# Altium schematic sheet fpga-bank3.SchDoc: FPGA - Bank 3
size Legal; CheckedBy: J. Brinton; CompanyName: Signal Laboratories, Inc.; DrawnBy: J. Brinton; Engineer: J. Brinton; Address1: 3479 Edison Way; Address2: Menlo Park CA 94025; Address3: +1 (877) 778-8435; Address4: siglabs.com; DocumentNumber: 30; Revision: 2b; SheetNumber: 31; SheetTotal: 58
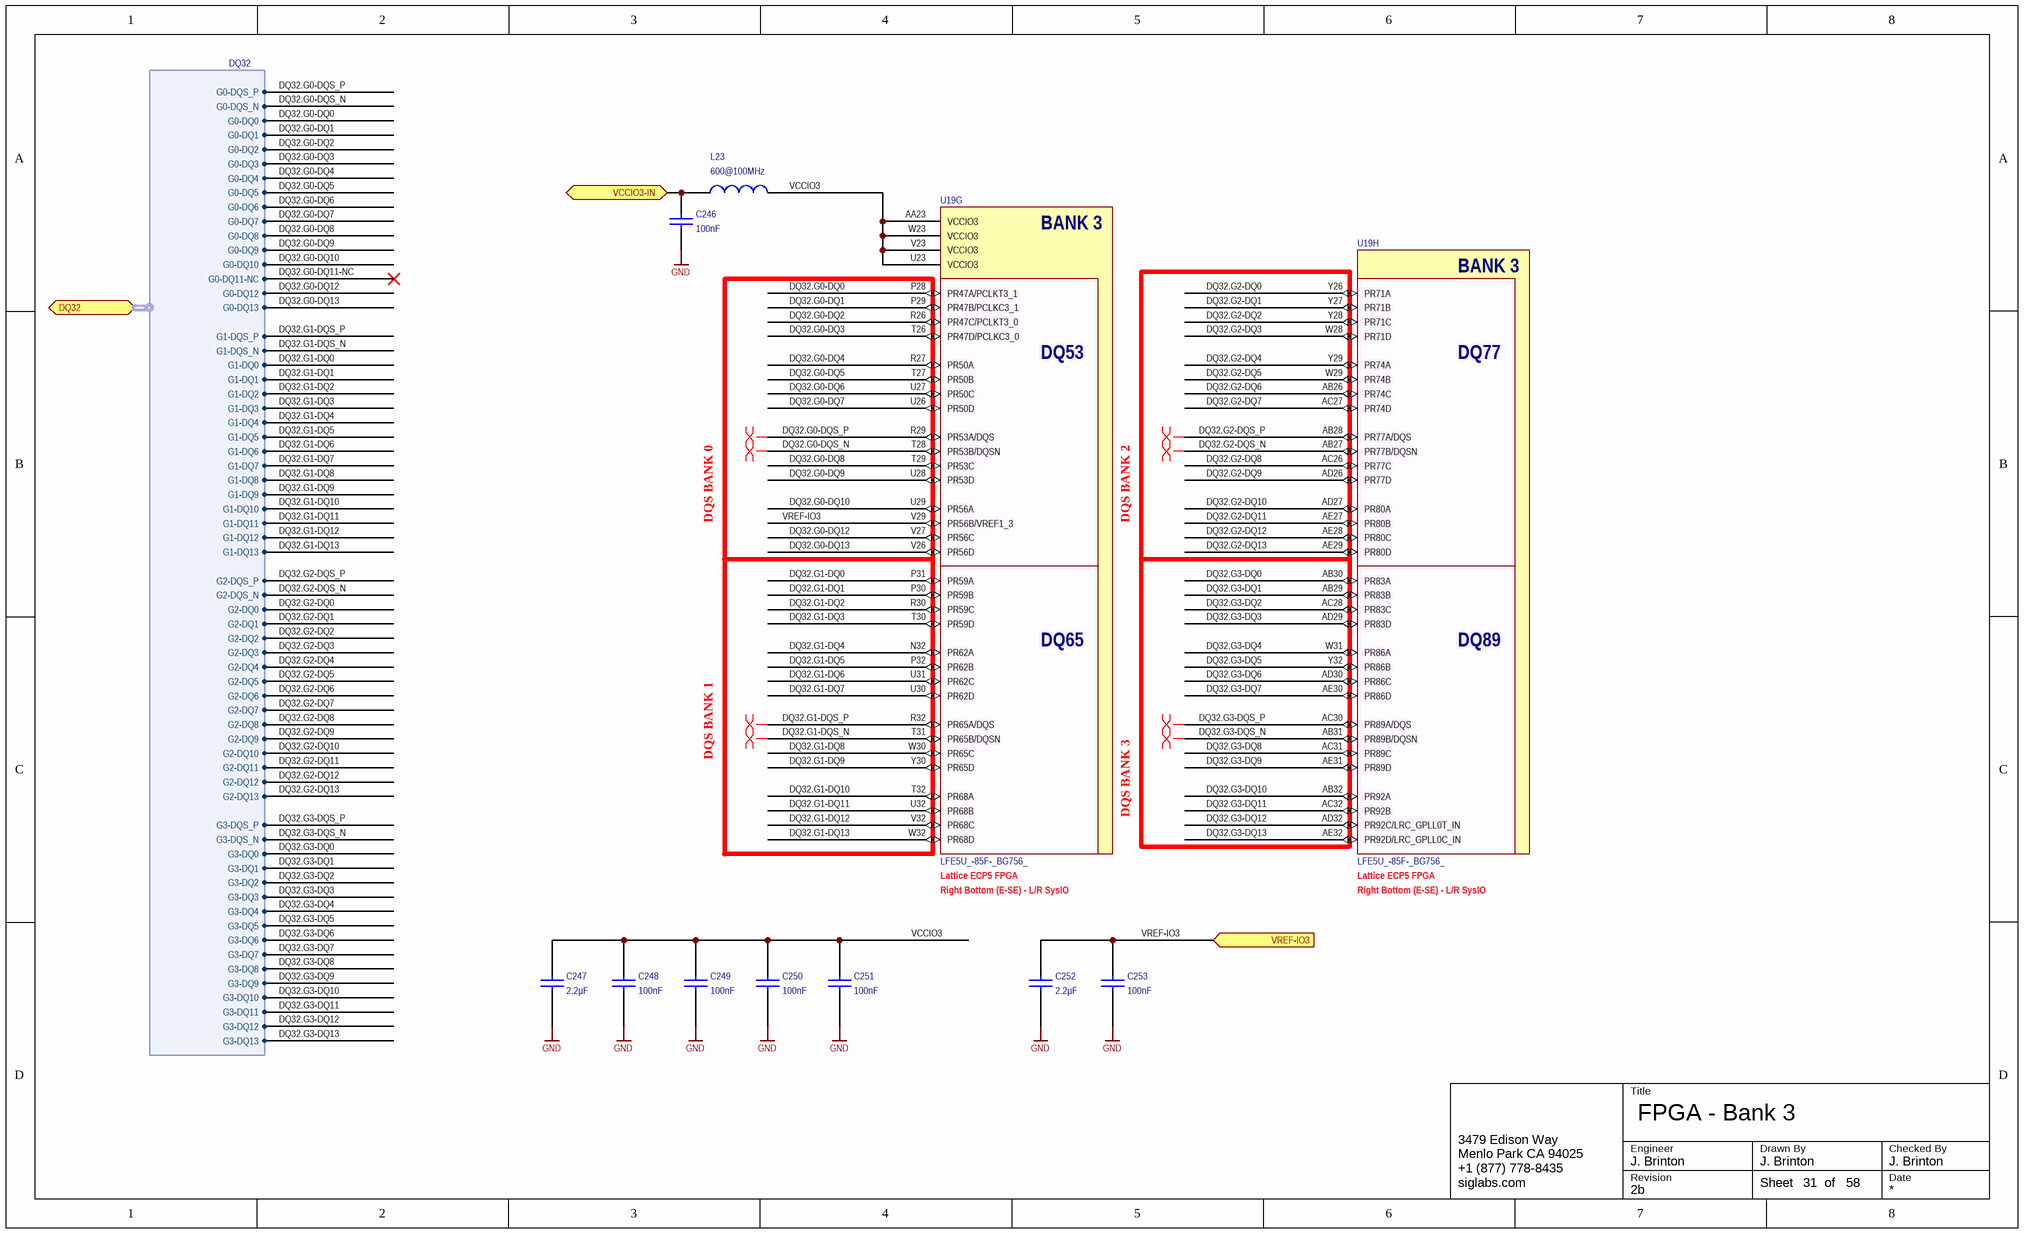
[diagram p0: fpga-bank3.SchDoc]

## Parts
C246  value 100nF  [CAPC1005X56N]  (hidden comment: GRM155R71C104KA88J)
C247  value 2.2µF  [CAPC1608X90N]  (hidden comment: GRM21BR71C225KA12L)
C248  value 100nF  [CAPC1005X56N]  (hidden comment: GRM155R71C104KA88J)
C249  value 100nF  [CAPC1005X56N]  (hidden comment: GRM155R71C104KA88J)
C250  value 100nF  [CAPC1005X56N]  (hidden comment: GRM155R71C104KA88J)
C251  value 100nF  [CAPC1005X56N]  (hidden comment: GRM155R71C104KA88J)
C252  value 2.2µF  [CAPC1608X90N]  (hidden comment: GRM21BR71C225KA12L)
C253  value 100nF  [CAPC1005X56N]  (hidden comment: GRM155R71C104KA88J)
L23  value 600@100MHz  [0402]  (hidden comment: BLM15PX601SN1D)
U19  LFE5U_-85F-_BG756_  [caBGA756]  (parts G,H of 19)

## Ports
DQ32 (harness DQ32), VCCIO3-IN, VREF-IO3 (in)

## Harnesses
DQ32: G0-DQS_P, G0-DQS_N, G0-DQ0, G0-DQ1, G0-DQ2, G0-DQ3, G0-DQ4, G0-DQ5, G0-DQ6, G0-DQ7, G0-DQ8, G0-DQ9, G0-DQ10, G0-DQ11-NC, G0-DQ12, G0-DQ13, G1-DQS_P, G1-DQS_N, G1-DQ0, G1-DQ1, G1-DQ2, G1-DQ3, G1-DQ4, G1-DQ5, G1-DQ6, G1-DQ7, G1-DQ8, G1-DQ9, G1-DQ10, G1-DQ11, G1-DQ12, G1-DQ13, G2-DQS_P, G2-DQS_N, G2-DQ0, G2-DQ1, G2-DQ2, G2-DQ3, G2-DQ4, G2-DQ5, G2-DQ6, G2-DQ7, G2-DQ8, G2-DQ9, G2-DQ10, G2-DQ11, G2-DQ12, G2-DQ13, G3-DQS_P, G3-DQS_N, G3-DQ0, G3-DQ1, G3-DQ2, G3-DQ3, G3-DQ4, G3-DQ5, G3-DQ6, G3-DQ7, G3-DQ8, G3-DQ9, G3-DQ10, G3-DQ11, G3-DQ12, G3-DQ13

## Nets
GND: C246.1 C247.1 C248.1 C249.1 C250.1 C251.1 C252.1 C253.1
DQ32.G0-DQ0: U19.P28(PR47A/PCLKT3_1) ; port DQ32.G0-DQ0
DQ32.G0-DQ1: U19.P29(PR47B/PCLKC3_1) ; port DQ32.G0-DQ1
DQ32.G0-DQ2: U19.R26(PR47C/PCLKT3_0) ; port DQ32.G0-DQ2
DQ32.G0-DQ3: U19.T26(PR47D/PCLKC3_0) ; port DQ32.G0-DQ3
DQ32.G0-DQ4: U19.R27(PR50A) ; port DQ32.G0-DQ4
DQ32.G0-DQ5: U19.T27(PR50B) ; port DQ32.G0-DQ5
DQ32.G0-DQ6: U19.U27(PR50C) ; port DQ32.G0-DQ6
DQ32.G0-DQ7: U19.U26(PR50D) ; port DQ32.G0-DQ7
DQ32.G0-DQ8: U19.T29(PR53C) ; port DQ32.G0-DQ8
DQ32.G0-DQ9: U19.U28(PR53D) ; port DQ32.G0-DQ9
DQ32.G0-DQ10: U19.U29(PR56A) ; port DQ32.G0-DQ10
DQ32.G0-DQ11-NC: port DQ32.G0-DQ11-NC
DQ32.G0-DQ12: U19.V27(PR56C) ; port DQ32.G0-DQ12
DQ32.G0-DQ13: U19.V26(PR56D) ; port DQ32.G0-DQ13
DQ32.G0-DQS_N: U19.T28(PR53B/DQSN) ; port DQ32.G0-DQS_N
DQ32.G0-DQS_P: U19.R29(PR53A/DQS) ; port DQ32.G0-DQS_P
DQ32.G1-DQ0: U19.P31(PR59A) ; port DQ32.G1-DQ0
DQ32.G1-DQ1: U19.P30(PR59B) ; port DQ32.G1-DQ1
DQ32.G1-DQ2: U19.R30(PR59C) ; port DQ32.G1-DQ2
DQ32.G1-DQ3: U19.T30(PR59D) ; port DQ32.G1-DQ3
DQ32.G1-DQ4: U19.N32(PR62A) ; port DQ32.G1-DQ4
DQ32.G1-DQ5: U19.P32(PR62B) ; port DQ32.G1-DQ5
DQ32.G1-DQ6: U19.U31(PR62C) ; port DQ32.G1-DQ6
DQ32.G1-DQ7: U19.U30(PR62D) ; port DQ32.G1-DQ7
DQ32.G1-DQ8: U19.W30(PR65C) ; port DQ32.G1-DQ8
DQ32.G1-DQ9: U19.Y30(PR65D) ; port DQ32.G1-DQ9
DQ32.G1-DQ10: U19.T32(PR68A) ; port DQ32.G1-DQ10
DQ32.G1-DQ11: U19.U32(PR68B) ; port DQ32.G1-DQ11
DQ32.G1-DQ12: U19.V32(PR68C) ; port DQ32.G1-DQ12
DQ32.G1-DQ13: U19.W32(PR68D) ; port DQ32.G1-DQ13
DQ32.G1-DQS_N: U19.T31(PR65B/DQSN) ; port DQ32.G1-DQS_N
DQ32.G1-DQS_P: U19.R32(PR65A/DQS) ; port DQ32.G1-DQS_P
DQ32.G2-DQ0: U19.Y26(PR71A) ; port DQ32.G2-DQ0
DQ32.G2-DQ1: U19.Y27(PR71B) ; port DQ32.G2-DQ1
DQ32.G2-DQ2: U19.Y28(PR71C) ; port DQ32.G2-DQ2
DQ32.G2-DQ3: U19.W28(PR71D) ; port DQ32.G2-DQ3
DQ32.G2-DQ4: U19.Y29(PR74A) ; port DQ32.G2-DQ4
DQ32.G2-DQ5: U19.W29(PR74B) ; port DQ32.G2-DQ5
DQ32.G2-DQ6: U19.AB26(PR74C) ; port DQ32.G2-DQ6
DQ32.G2-DQ7: U19.AC27(PR74D) ; port DQ32.G2-DQ7
DQ32.G2-DQ8: U19.AC26(PR77C) ; port DQ32.G2-DQ8
DQ32.G2-DQ9: U19.AD26(PR77D) ; port DQ32.G2-DQ9
DQ32.G2-DQ10: U19.AD27(PR80A) ; port DQ32.G2-DQ10
DQ32.G2-DQ11: U19.AE27(PR80B) ; port DQ32.G2-DQ11
DQ32.G2-DQ12: U19.AE28(PR80C) ; port DQ32.G2-DQ12
DQ32.G2-DQ13: U19.AE29(PR80D) ; port DQ32.G2-DQ13
DQ32.G2-DQS_N: U19.AB27(PR77B/DQSN) ; port DQ32.G2-DQS_N
DQ32.G2-DQS_P: U19.AB28(PR77A/DQS) ; port DQ32.G2-DQS_P
DQ32.G3-DQ0: U19.AB30(PR83A) ; port DQ32.G3-DQ0
DQ32.G3-DQ1: U19.AB29(PR83B) ; port DQ32.G3-DQ1
DQ32.G3-DQ2: U19.AC28(PR83C) ; port DQ32.G3-DQ2
DQ32.G3-DQ3: U19.AD29(PR83D) ; port DQ32.G3-DQ3
DQ32.G3-DQ4: U19.W31(PR86A) ; port DQ32.G3-DQ4
DQ32.G3-DQ5: U19.Y32(PR86B) ; port DQ32.G3-DQ5
DQ32.G3-DQ6: U19.AD30(PR86C) ; port DQ32.G3-DQ6
DQ32.G3-DQ7: U19.AE30(PR86D) ; port DQ32.G3-DQ7
DQ32.G3-DQ8: U19.AC31(PR89C) ; port DQ32.G3-DQ8
DQ32.G3-DQ9: U19.AE31(PR89D) ; port DQ32.G3-DQ9
DQ32.G3-DQ10: U19.AB32(PR92A) ; port DQ32.G3-DQ10
DQ32.G3-DQ11: U19.AC32(PR92B) ; port DQ32.G3-DQ11
DQ32.G3-DQ12: U19.AD32(PR92C/LRC_GPLL0T_IN) ; port DQ32.G3-DQ12
DQ32.G3-DQ13: U19.AE32(PR92D/LRC_GPLL0C_IN) ; port DQ32.G3-DQ13
DQ32.G3-DQS_N: U19.AB31(PR89B/DQSN) ; port DQ32.G3-DQS_N
DQ32.G3-DQS_P: U19.AC30(PR89A/DQS) ; port DQ32.G3-DQS_P
VCCIO3: C247.2 C248.2 C249.2 C250.2 C251.2 L23.1 U19.AA23(VCCIO3) U19.U23(VCCIO3) U19.V23(VCCIO3) U19.W23(VCCIO3)
VCCIO3-IN: C246.2 L23.2 ; port VCCIO3-IN
VREF-IO3: C252.2 C253.2 U19.V29(PR56B/VREF1_3) ; port VREF-IO3

## Layout directives
differential pair: DQ32.G0-DQS_N, DQ32.G0-DQS_P, DQ32.G1-DQS_N, DQ32.G1-DQS_P, DQ32.G2-DQS_N, DQ32.G2-DQS_P, DQ32.G3-DQS_N, DQ32.G3-DQS_P

## Notes on the sheet
- DQS BANK 0
- DQS BANK 2
- DQS BANK 1
- DQS BANK 3
- (near U19) Right Bottom (E-SE) - L/R SysIO
- (near U19) Lattice ECP5 FPGA
- Title
- Engineer
- Revision
- Drawn By
- Checked By
- Date
- Sheet
- of
- (in symbol LFE5U_-85F-_BG756_, part G) BANK 3; DQ53; DQ65
- (in symbol LFE5U_-85F-_BG756_, part H) BANK 3; DQ77; DQ89

## Library data of the parts
C246 C248-C251 C253 = GRM155R71A104KA01J: Ceramic Capacitor 100nF ±10% 16V X7R 0402; Manufacturer: Murata; Tr: -55:125; Manufacturer P/N: GRM155R71C104KA88J; Tolerance: ±10%; Package: 0402; Voltage: 16V
C247 C252 = GRM188R71A225KE15D: Ceramic Capacitor 2.2uF ±10% 10V X7R 0603; Manufacturer: Murata; Tr: -55:125; Manufacturer P/N: GRM188R71A225KE15D; Tolerance: ±10%; Package: 0603; Voltage: 10V
L23 = IND 0402: Ferrite Bead 600-Ohm @ 100MHz 900mA 0402; Manufacturer: Murata; Tolerance: ±25%; Tr: -55:125; Manufacturer P/N: BLM15PX601SN1D; Package: 0402
U19 = LFE5U_-85F-_BG756_: ECP5 FPGA, 85k LUT, 756-caBGA; Manufacturer: Lattice Semiconductor; Manufacturer P/N: LFE5U_-85F-_BG756_